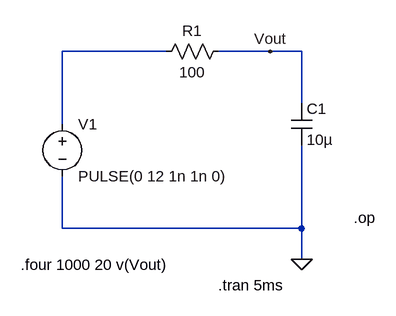
[diagram p0: schematic Part 2- DC analysis b.asc]
Part 2- DC analysis b.asc, the LTspice schematic file:
Version 4
SHEET 1 912 680
WIRE 352 208 192 208
WIRE 512 208 432 208
WIRE 560 208 512 208
WIRE 560 288 560 208
WIRE 192 320 192 208
WIRE 192 480 192 400
WIRE 560 480 560 352
WIRE 560 480 192 480
WIRE 560 528 560 480
FLAG 560 528 0
FLAG 512 208 Vout
SYMBOL voltage 192 304 R0
SYMATTR InstName V1
SYMATTR Value PULSE(0 12 1n 1n 0)
SYMBOL res 448 192 R90
WINDOW 0 0 56 VBottom 2
WINDOW 3 32 56 VTop 2
SYMATTR InstName R1
SYMATTR Value 100
SYMBOL cap 544 288 R0
SYMATTR InstName C1
SYMATTR Value 10µ
TEXT 640 464 Left 2 !.op
TEXT 128 536 Left 2 !.four 1000 20 v(Vout)
TEXT 432 568 Left 2 !.tran 5ms

The netlist it stands for:
* Part 2- DC analysis b.asc
V1 N001 0 PULSE(0 12 1n 1n 0)
R1 Vout N001 100
C1 Vout 0 10µ
.op
.four 1000 20 v(Vout)
.tran 5ms
.backanno
.end